# EAGLE design Board Bawah (EAGLE 9.6.2)
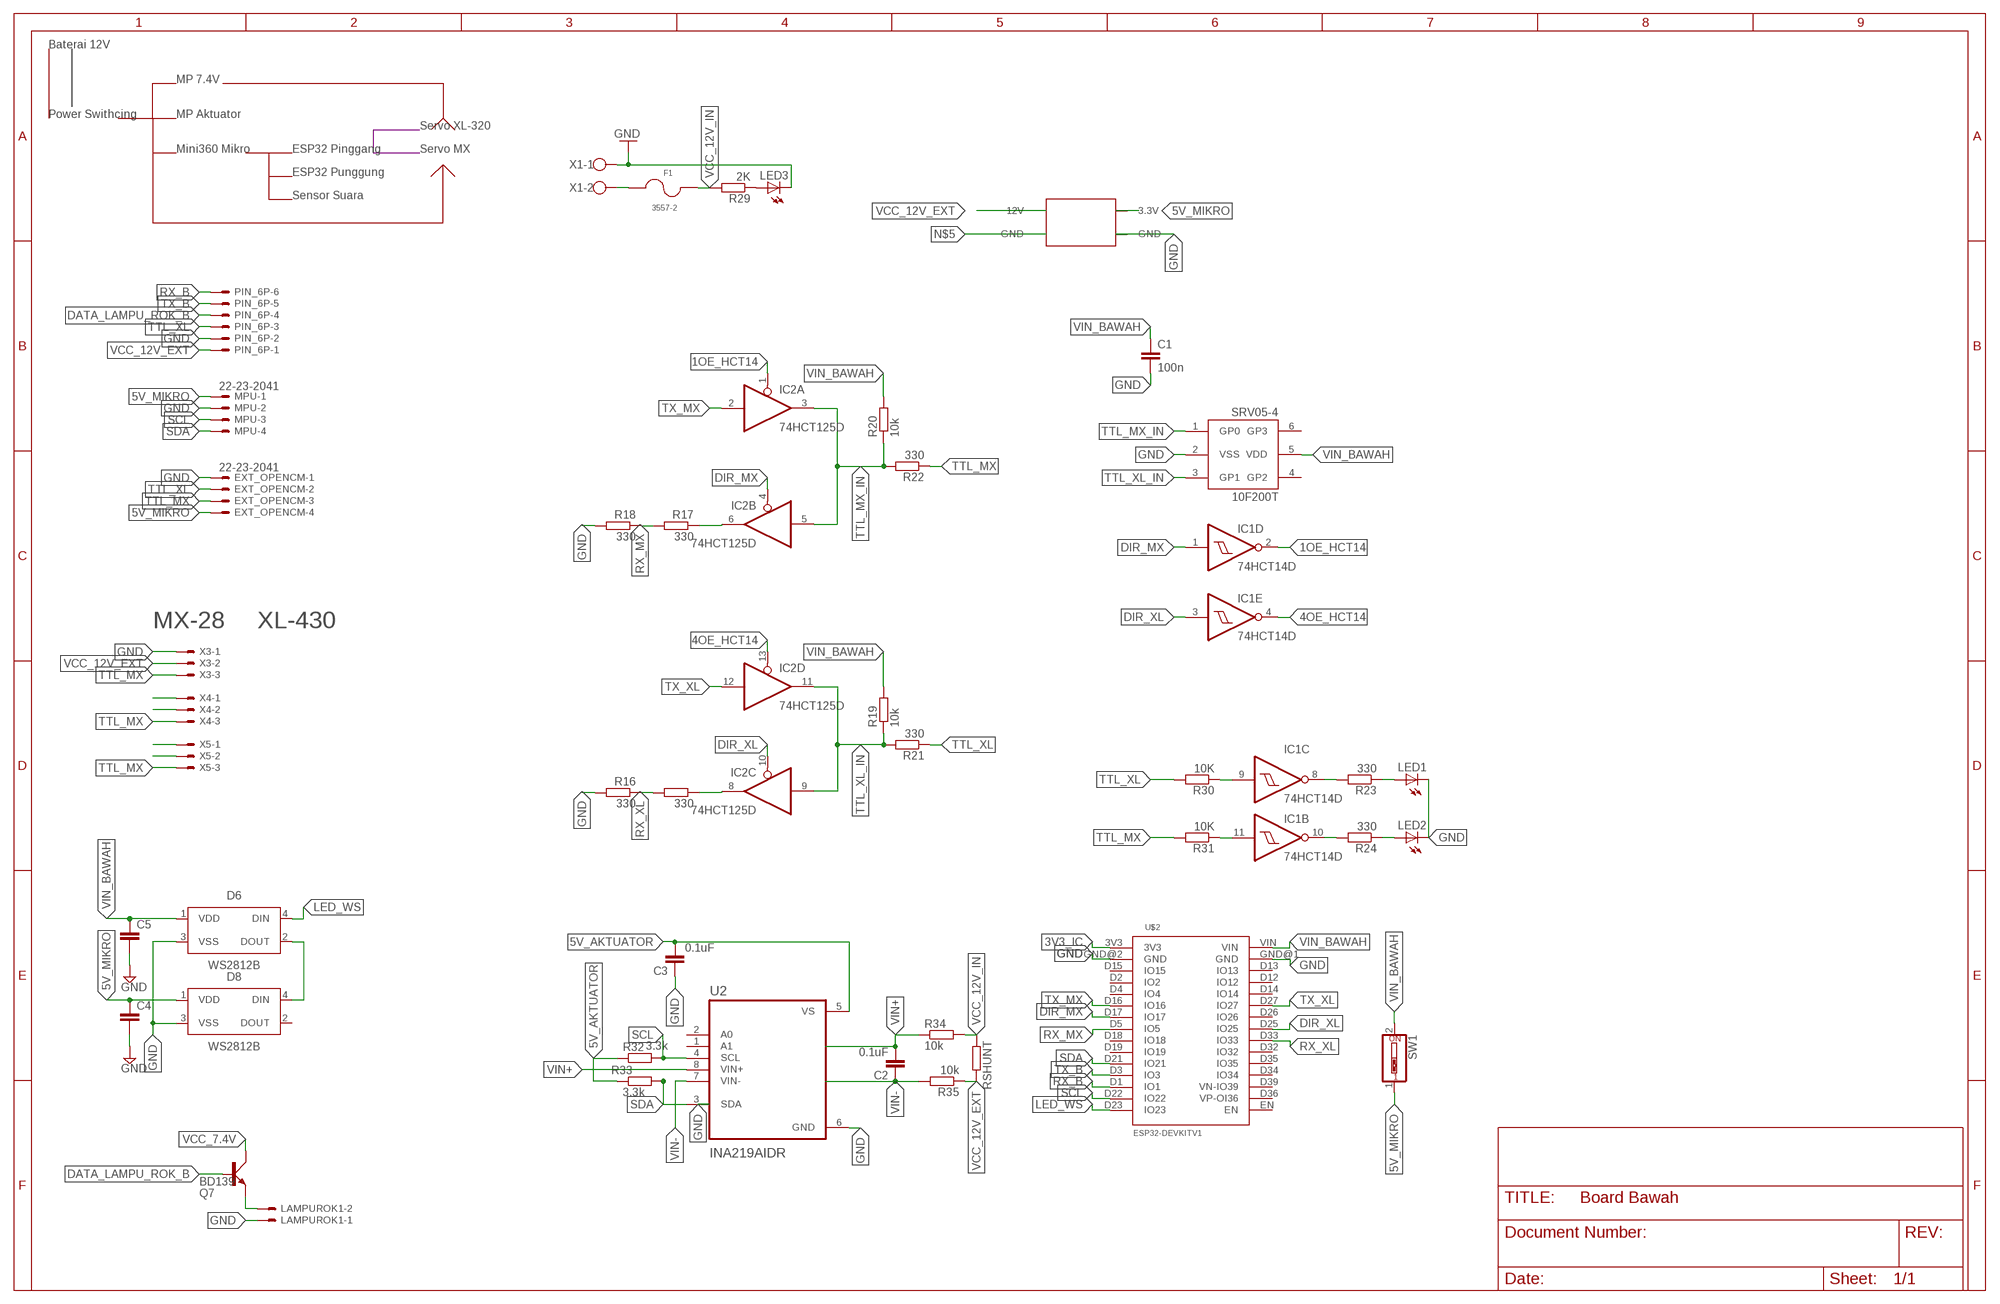
[diagram p0: schematic, sheet 1]

## Parts
C1  100n  C-EUC0805  [C0805]
C2  0.1uF  C-EUC0805  [C0805]
C3  0.1uF  C-EUC0805  [C0805]
C4  C-EUC0805  [C0805]
C5  C-EUC0805  [C0805]
D6  WS2812B  [WS2812B]
D8  WS2812B  [WS2812B]
EXT_OPENCM  22-23-2041  [22-23-2041]
F1  3557-2  [FUSE_3557-2]
IC1  74HCT14D  [SO14]
IC2  74HCT125D  [SO14]
LAMPUROK1  22-23-2021  [22-23-2021]
LED1  LEDCHIPLED_1206  [CHIPLED_1206]
LED2  LEDCHIPLED_1206  [CHIPLED_1206]
LED3  LEDCHIPLED_1206  [CHIPLED_1206]
MPU  22-23-2041  [22-23-2041]
PIN_6P  22-23-2061  [22-23-2061]
Q7  BD139  [TO126AV]
R13  330  R-EU_R0805  [R0805]
R16  330  R-EU_R0805  [R0805]
R17  330  R-EU_R0805  [R0805]
R18  330  R-EU_R0805  [R0805]
R19  10k  R-EU_R0805  [R0805]
R20  10k  R-EU_R0805  [R0805]
R21  330  R-EU_R0805  [R0805]
R22  330  R-EU_R0805  [R0805]
R23  330  R-EU_R0805  [R0805]
R24  330  R-EU_R0805  [R0805]
R29  2K  R-EU_R0805  [R0805]
R30  10K  R-EU_R0805  [R0805]
R31  10K  R-EU_R0805  [R0805]
R32  3.3k  R-EU_R0805  [R0805]
R33  3.3k  R-EU_R0805  [R0805]
R34  10k  R-EU_R0805  [R0805]
R35  10k  R-EU_R0805  [R0805]
RSHUNT  R-EU_R2512  [R2512]
SRV05-4  10F200T  [SOT23-6]
SW1  SW_DIP-1  [EDG-01]
U2  INA219AIDR  [SOIC127P599X175-8N]
U$2  ESP32DEVKITV1  [ESP32-DEVKITV1]
U$5  MP2307-MINI-360  [MP2307-MINI-360]
X1  W237-102  [W237-102]
X3  22-23-2031  [22-23-2031]
X4  22-23-2031  [22-23-2031]
X5  22-23-2031  [22-23-2031]

## Nets
1OE_HCT14: IC1.2(D:O) IC2.1(A:OE)
3V3_IC: U$2.3V3
4OE_HCT14: IC1.4(E:O) IC2.13(D:OE)
5V_AKTUATOR: C3.2 R32.1 R33.1 U2.5(VS)
5V_MIKRO: C4.1 D8.1(VDD) EXT_OPENCM.4 MPU.1 SW1.1 U$5.V+OUT(3.3V)
DATA_LAMPU_ROK_B: PIN_6P.4 Q7.B
DIR_MX: IC1.1(D:I) IC2.4(B:OE) U$2.D17(IO17)
DIR_XL: IC1.3(E:I) IC2.10(C:OE) U$2.D25(IO25)
GND: C1.2 C3.1 C4.2 C5.2 D6.3(VSS) D8.3(VSS) EXT_OPENCM.1 LAMPUROK1.1 LED1.C LED2.C LED3.C MPU.2 PIN_6P.2 R16.2 R18.2 SRV05-4.2(VSS) U2.6(GND) U$2.GND@1(GND) U$2.GND@2(GND) U$5.GND_OUT(GND) X1.1 X3.1 X4.1 X5.1
LED_WS: D6.4(DIN) U$2.D23(IO23)
N$1: LAMPUROK1.2 Q7.E
N$3: IC1.8(C:O) R23.2
N$5: U$5.GND_IN(GND)
N$7: IC1.9(C:I) R30.1
N$8: LED1.A R23.1
N$9: F1.1_1 F1.1_2 X1.2
N$10: IC1.10(B:O) R24.2
N$11: LED2.A R24.1
N$14: LED3.A R29.1
N$18: IC1.11(B:I) R31.1
N$21: IC2.6(B:O) R17.1
N$25: IC2.8(C:O) R13.1
N$26: D6.2(DOUT) D8.4(DIN)
RX_B: PIN_6P.6 U$2.D1(IO1)
RX_MX: R17.2 R18.1 U$2.D5(IO5)
RX_XL: R13.2 R16.1 U$2.D33(IO33)
SCL: MPU.3 R32.2 U2.4(SCL) U$2.D22(IO22)
SDA: MPU.4 R33.2 U2.3(SDA) U$2.D21(IO21)
TTL_MX: EXT_OPENCM.3 R22.1 R31.2 X3.3 X4.3 X5.3
TTL_MX_IN: IC2.3(A:O) IC2.5(B:I) R20.1 R22.2 SRV05-4.1(GP0)
TTL_XL: EXT_OPENCM.2 PIN_6P.3 R21.1 R30.2
TTL_XL_IN: IC2.9(C:I) IC2.11(D:O) R19.1 R21.2 SRV05-4.3(GP1)
TX_B: PIN_6P.5 U$2.D3(IO3)
TX_MX: IC2.2(A:I) U$2.D16(IO16)
TX_XL: IC2.12(D:I) U$2.D27(IO27)
VCC_7.4V: Q7.C
VCC_12V_EXT: PIN_6P.1 R35.1 RSHUNT.2 U$5.V+IN(12V) X3.2 X4.2 X5.2
VCC_12V_IN: F1.2_1 F1.2_2 R29.2 R34.2 RSHUNT.1
VIN+: C2.2 R34.1 U2.8(VIN+)
VIN-: C2.1 R35.2 U2.7(VIN-)
VIN_BAWAH: C1.1 C5.1 D6.1(VDD) R19.2 R20.2 SRV05-4.5(VDD) SW1.2 U$2.VIN
Unconnected: D8.2(DOUT) IC1.5(F:I) IC1.6(F:O) IC1.12(A:O) IC1.13(A:I) SRV05-4.4(GP2) SRV05-4.6(GP3) U2.1(A1) U2.2(A0) U$2.D2(IO2) U$2.D4(IO4) U$2.D12(IO12) U$2.D13(IO13) U$2.D14(IO14) U$2.D15(IO15) U$2.D18(IO18) U$2.D19(IO19) U$2.D26(IO26) U$2.D32(IO32) U$2.D34(IO34) U$2.D35(IO35) U$2.D36(VP-OI36) U$2.D39(VN-IO39) U$2.EN

## Notes on the sheet
- Baterai 12V
- MP 7.4V
- Power Swithcing | MP Aktuator
- Servo XL-320
- Mini360 Mikro | ESP32 Pinggang | Servo MX
- ESP32 Punggung
- Sensor Suara
- MX-28 | XL-430

## Power pins joined to a net without a drawn wire
GND: IC1.7(P:GND) IC2.7(P:GND)
VIN_BAWAH: IC1.14(P:VIN_BAWAH) IC2.14(P:VIN_BAWAH)

## Library data of the parts
C1-C5 = rcl:C-EU: CAPACITOR, European symbol; SPICEPREFIX: C
D6 D8 = LED:WS2812B: Intelligent control LED integrated light source Datasheet <http://cdn.sparkfun.com/datasheets/BreakoutBoards/WS2812B.pdf>; CATEGORY: LED; COLOR: RGB; DESCRIPTION: LED integrated light source; MANUFACTURER: Worldsemi; MPN: WS2812B; OPERATING_TEMP: -25 ℃ to +80℃(TJ); PART_STATUS: Active; SUB_CATEGORY: RGB
EXT_OPENCM MPU = con-molex:22-23-2041: .100" (2.54mm) Center Header - 4 Pin; MF: MOLEX; MPN: 22-23-2041; OC_FARNELL: 1462920; OC_NEWARK: 38C0355
F1 = 3557-2:3557-2: Check availability <https://pricing.snapeda.com/parts/3557-2/Keystone%20Electronics/view-part?ref=eda>; AVAILABILITY: In Stock; DESCRIPTION: THM 2 in 1 Auto Blade Holder; MF: Keystone Electronics; MP: 3557-2; PACKAGE: Nonstandard Keystone; PRICE: None; PURCHASE-URL: https://pricing.snapeda.com/search?q=3557-2&ref=eda
IC1 = 74xx-eu:74*14: Hex schmitt trigger INVERTER; SPICEPREFIX: I
IC2 = 74xx-eu:74*125: Quad bus BUFFER, 3-state
LAMPUROK1 = con-molex:22-23-2021: .100" (2.54mm) Center Header - 2 Pin; MF: MOLEX; MPN: 22-23-2021; OC_FARNELL: 1462926; OC_NEWARK: 25C3832
LED1-LED3 = led:LED: LED OSRAM: - CHIPLED LG R971, LG N971, LY N971, LG Q971, LY Q971, LO R971, LY R971 LH N974, LH R974 LS Q976, LO Q976, LY Q976 LO Q996 - Hyper CHIPLED LW Q18S LB Q993, LB Q99A, LB R99A - SideLED LS A670, LO A670, LY A670, LG A670, LP A670 LB A673, LV A673, LT A673, LW A673 LH A674 LY A675 LS A676, LA A676, LO A676, LY A676, LW A676 LS A679, LY A679, LG A679 - Hyper Micro SIDELED® LS Y876, LA Y876, LO Y876, LY Y876 LT Y87S - SmartLED LW L88C, LW L88S LB L89C, LB L89S, LG L890 LS L89K, LO L89K, LY L89K LS L896, LA L896, LO L896, LY L896 - TOPLED LS T670, LO T670, LY T670, LG T670, LP T670 LSG T670, LSP T670, LSY T670, LOP T670, LYG T670 LG T671, LOG T671, LSG T671 LB T673, LV T673, LT T673, LW T673 LH T674 LS T676, LA T676, LO T676, LY T676, LB T676, LH T676, LSB T676, LW T676 LB T67C, LV T67C, LT T67C, LS T67K, LO T67K, LY T67K, LW E67C LS E67B, LA E67B, LO E67B, LY E67B, LB E67C, LV E67C, LT E67C LW T67C LS T679, LY T679, LG T679 LS T770, LO T770, LY T770, LG T770, LP T770 LB T773, LV T773, LT T773, LW T773 LH T774 LS E675, LA E675, LY E675, LS T675 LS T776, LA T776, LO T776, LY T776, LB T776 LHGB T686 LT T68C, LB T68C - Hyper Mini TOPLED® LB M676 - Mini TOPLED Santana® LG M470 LS M47K, LO M47K, LY M47K Source: http://www.osram.convergy.de LUXEON: - LUMILED® LXK2-PW12-R00, LXK2-PW12-S00, LXK2-PW14-U00, LXK2-PW14-V00 LXK2-PM12-R00, LXK2-PM12-S00, LXK2-PM14-U00 LXK2-PE12-Q00, LXK2-PE12-R00, LXK2-PE12-S00, LXK2-PE14-T00, LXK2-PE14-U00 LXK2-PB12-K00, LXK2-PB12-L00, LXK2-PB12-M00, LXK2-PB14-N00, LXK2-PB14-P00, LXK2-PB14-Q00 LXK2-PR12-L00, LXK2-PR12-M00, LXK2-PR14-Q00, LXK2-PR14-R00 LXK2-PD12-Q00, LXK2-PD12-R00, LXK2-PD12-S00 LXK2-PH12-R00, LXK2-PH12-S00 LXK2-PL12-P00, LXK2-PL12-Q00, LXK2-PL12-R00 Source: www.luxeon.com KINGBRIGHT: KA-3528ASYC Source: www.kingbright.com
PIN_6P = con-molex:22-23-2061: .100" (2.54mm) Center Header - 6 Pin; MF: MOLEX; MPN: 22-23-2061; OC_FARNELL: 1462922; OC_NEWARK: 27C1933
Q7 = transistor-power:BD139: NPN TRANSISTOR
R13 R16-R24 R29-R35 = resistor:R-EU_: RESISTOR, European symbol
RSHUNT = rcl:R-EU_: RESISTOR, European symbol; SPICEPREFIX: R
SRV05-4 = adafruit:10F200T: PIC10F200/202/204/206 Ultra-small 8-bit PIC micros in SOT-23-6 and SOIC
SW1 = special:SW_DIP-1: DIP SWITCH
U2 = INA219AIDR:INA219AIDR: Check availability <https://pricing.snapeda.com/parts/INA219AIDR/Texas%20Instruments/view-part?ref=eda>; AVAILABILITY: In Stock; CHECK_PRICES: https://www.snapeda.com/parts/INA219AIDR/Texas+Instruments/view-part/?ref=eda; DESCRIPTION: 26-V 12-bit I2C output digital power monitor; MF: Texas Instruments; MP: INA219AIDR; PACKAGE: SOIC-8 Texas Instruments; PRICE: None; PURCHASE-URL: https://www.snapeda.com/api/url_track_click_mouser/?unipart_id=423666&manufacturer=Texas Instruments&part_name=INA219AIDR&search_term=ina219; SNAPEDA_LINK: https://www.snapeda.com/parts/INA219AIDR/Texas+Instruments/view-part/?ref=snap
U$2 = ESP32-DEVKITV1:ESP32DEVKITV1
U$5 = MP2307-MINI-360:MP2307-MINI-360
X1 = con-wago-500:W237-102: WAGO SCREW CLAMP; MPN: 237-102; OC_FARNELL: unknown; OC_NEWARK: 70K9898
X3-X5 = con-molex:22-23-2031: .100" (2.54mm) Center Header - 3 Pin; MF: MOLEX; MPN: 22-23-2031; OC_FARNELL: 1462950; OC_NEWARK: 30C0862

## Board
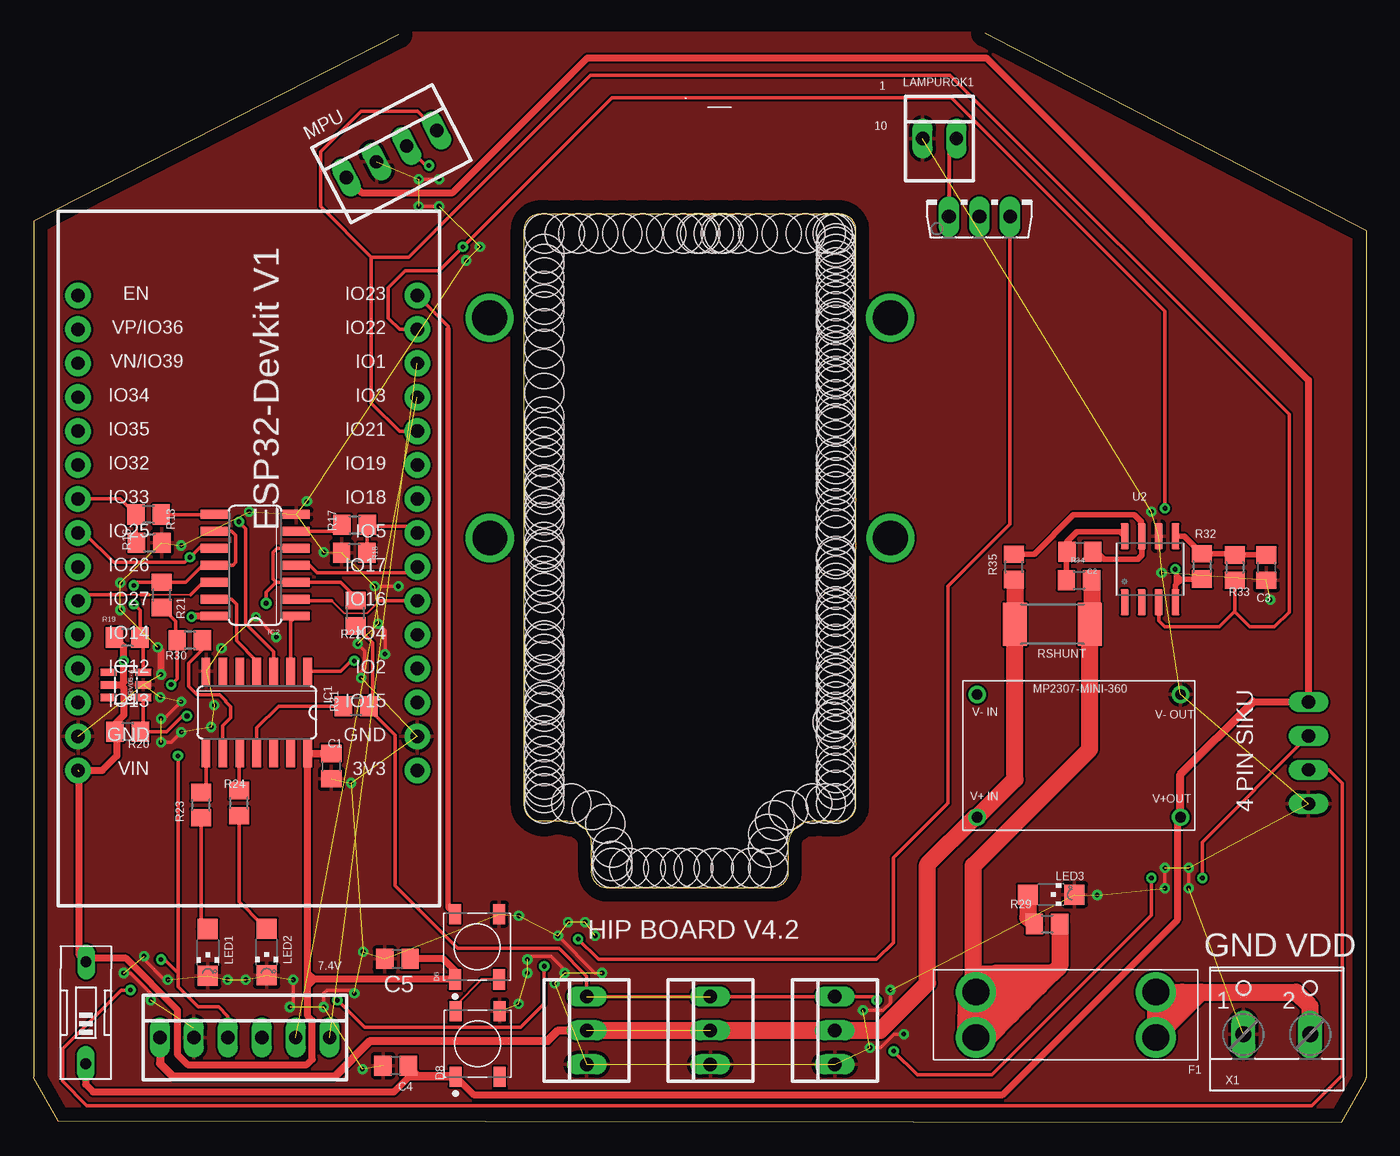
[diagram p1: board, top side]
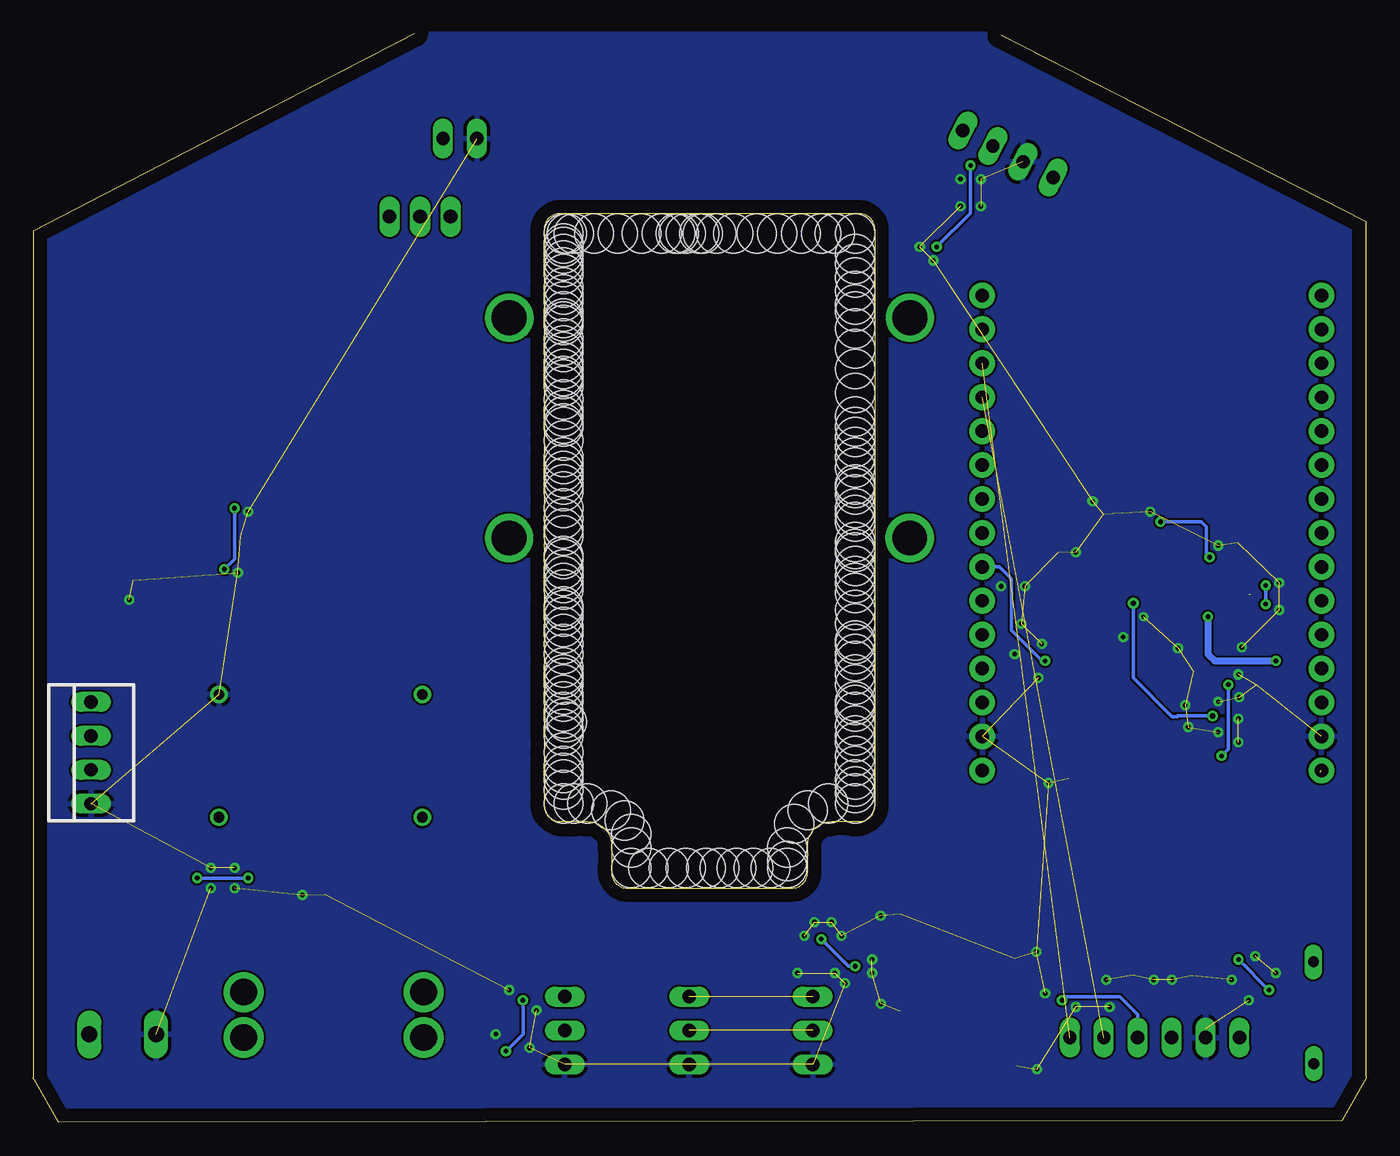
[diagram p2: board, bottom side, seen from below]

Size 99.8 x 81.53 mm. Coordinates in mm from the lower left corner, seen from the top.
Outline: 40.01,68.03 37.96,68.03 arc90 36.76,66.83 36.76,23.74 arc90 37.96,22.54 40.01,22.54 arc-90 41.81,20.74 41.81,18.74 arc90 43.01,17.54 55.31,17.54 arc90 56.51,18.74 56.51,20.74 arc-90 58.31,22.54 60.36,22.54 arc90 61.56,23.74 61.56,66.83 arc90 60.36,68.03 58.31,68.03
Outline: 39.94,68.03 58.39,68.03
Outline: 71.24,81.53 99.8,66.74 99.8,3.35 99.78,3.22 97.96,0 1.82,0.13 0,3.35 0.02,3.47 0.02,67.46 27.33,81.43
Copper layers (1*16): Top 0.035mm / dielectric 1.5mm / Bottom 0.035mm
Design rules "default": minimum track width 6mil, minimum drill 0.35mm, track to track 6mil, track to pad 6mil, pad to pad 6mil, via to via 6mil, smd to smd 6mil, copper to edge 40mil, drill to drill 6mil, minimum pad ring 10mil, minimum via ring 8mil, stop-mask expansion 4mil, vias tented up to drill 0mil, thermal gap 10mil
Holes 2.92 mm at 38.26,66.56 38.26,66.56 38.26,65.03 38.26,65.03 38.26,64.27 38.26,64.27 38.26,63.26 38.26,63.26 38.26,62.24 38.26,62.24 38.26,61.22 38.26,61.22 38.26,60.72 38.26,59.45 38.26,59.45 38.26,57.92 38.26,57.92 38.26,56.4 38.26,56.4 38.26,54.62 38.26,54.62 38.26,52.84 38.26,52.84 38.26,52.08 38.26,51.32 38.26,50.55 38.26,49.03 38.26,49.03 38.26,49.79 38.26,49.79 38.26,47.76 38.26,47.51 38.26,47 38.26,45.98 38.26,45.98 38.26,45.48 38.26,44.97 38.26,44.97 38.26,43.44 38.26,43.44 38.26,42.94 38.26,42.68 38.26,42.68 38.26,41.66 38.26,40.9 38.26,40.4 38.26,39.63 38.26,38.36 38.26,37.35 38.26,37.35 38.26,36.08 38.26,35.82 38.26,35.82 38.26,35.06 38.26,34.55 38.26,33.54 38.26,32.78 38.26,31.5 38.26,31.25 38.26,30.74 38.26,29.73 38.26,29.73 38.26,28.96 38.26,28.46 38.26,27.44 38.26,26.68 38.26,25.66 38.26,25.15 38.26,24.65 38.26,23.88 38.26,23.88 38.26,38.36 40.29,23.88 40.29,23.88 41.82,23.38 41.82,23.38 42.83,22.36 42.83,22.36 43.34,20.58 43.34,20.58 43.34,19.57 43.34,19.57 43.34,19.06 43.34,19.06 44.61,19.06 44.61,19.06 45.88,19.06 45.88,19.06 47.15,19.06 47.15,19.06 48.42,19.06 48.42,19.06 49.44,19.06 49.44,19.06 50.96,19.06 50.96,19.06 52.23,19.06 52.23,19.06 53.75,19.06 53.75,19.06 55.02,19.06 55.02,19.06 55.02,20.58 55.02,20.58 55.02,21.6 55.02,21.6 55.53,22.61 55.53,22.61 56.55,23.38 56.55,23.38 58.33,23.88 58.33,23.88 59.34,23.88 59.34,23.88 60.1,23.88 60.1,23.88 60.1,24.9 60.1,24.9 60.1,25.66 60.1,26.17 60.1,26.68 60.1,27.7 60.1,27.7 39.78,66.56 39.78,66.56 40.8,66.56 40.8,66.56 42.32,66.56 42.32,66.56 44.1,66.56 44.1,66.56 45.63,66.56 45.63,66.56 47.4,66.56 47.4,66.56 48.67,66.56 48.67,66.56 49.69,66.56 49.94,66.56 51.47,66.56 51.72,66.56 52.74,66.56 52.74,66.56 50.96,66.56 54.26,66.56 54.26,66.56 56.04,66.56 56.04,66.56 57.82,66.56 57.82,66.56 59.85,66.56 59.34,66.56 59.34,66.56 60.1,66.56 60.1,66.56 60.1,65.8 60.1,65.8 60.1,65.54 60.1,65.03 60.1,64.53 60.1,64.02 60.1,63.51 60.1,62.49 60.1,61.98 60.1,61.48 60.1,60.72 60.1,60.21 60.1,59.95 60.1,59.7 60.1,58.68 60.1,58.18 60.1,57.67 60.1,56.91 60.1,56.4 60.1,55.89 60.1,55.64 60.1,55.13 60.1,54.11 60.1,53.35 60.1,52.84 60.1,52.33 60.1,52.33 60.1,52.08 60.1,51.06 60.1,49.79 60.1,49.29 60.1,51.06 60.1,48.78 60.1,48.27 60.1,47.76 60.1,47.25 60.1,47.25 60.1,45.98 60.1,45.22 60.1,44.46 60.1,43.95 60.1,45.98 60.1,43.95 60.1,42.43 60.1,42.17 60.1,41.41 60.1,40.9 60.1,40.4 60.1,39.89 60.1,38.62 60.1,37.86 60.1,37.09 60.1,36.59 60.1,35.82 60.1,38.36 60.1,35.82 60.1,35.06 60.1,34.05 60.1,33.54 60.1,33.28 60.1,32.78 60.1,32.01 60.1,31.5 60.1,30.74 60.1,30.23 59.85,29.98 60.1,29.47 60.1,28.96

### Footprints (pad centres in the part's own frame; a part is rotated, then mirrored left to right if it is on the bottom)
C0805 = smd 1.3 x 1.5: 1 -0.95,0; 2 0.95,0
WS2812B = smd 1.5 x 0.9: 1 -2.45,1.65; 2 -2.45,-1.65; 3 2.45,-1.65; 4 2.45,1.65
22-23-2041 = drill 1 long: 1 -3.81,0; 2 -1.27,0; 3 1.27,0; 4 3.81,0
FUSE_3557-2 = drill 2: 1_1 -6.735,1.7; 1_2 -6.735,-1.7; 2_1 6.735,1.7; 2_2 6.735,-1.7
SO14 = smd 0.66 x 2.032: 1 -3.81,-3.073; 2 -2.54,-3.073; 3 -1.27,-3.073; 4 0,-3.073; 5 1.27,-3.073; 6 2.54,-3.073; 7 3.81,-3.073; 8 3.81,3.073; 9 2.54,3.073; 10 1.27,3.073; 11 0,3.073; 12 -1.27,3.073; 13 -2.54,3.073; 14 -3.81,3.073
22-23-2021 = drill 1 long: 1 -1.27,0; 2 1.27,0
CHIPLED_1206 = smd 1.5 x 1.5: A 0,-1.75; C 0,1.75
22-23-2061 = drill 1 long: 1 -6.35,0; 2 -3.81,0; 3 -1.27,0; 4 1.27,0; 5 3.81,0; 6 6.35,0
TO126AV = drill 1.016 long: B 2.286,-1.27; C 0,-1.27; E -2.286,-1.27
R0805 = smd 1.3 x 1.5: 1 -0.95,0; 2 0.95,0
R2512 = smd 1.8 x 3.2: 1 -2.8,0; 2 2.8,0
SOT23-6 = smd 0.55 x 1.2: 1 -0.95,-1.3; 2 0,-1.3; 3 0.95,-1.3; 4 0.95,1.3; 5 0,1.3; 6 -0.95,1.3
EDG-01 = drill 0.813 long: 1 0,-3.81; 2 0,3.81
SOIC127P599X175-8N = smd 1.97 x 0.6: 1 -2.47,1.905; 2 -2.47,0.635; 3 -2.47,-0.635; 4 -2.47,-1.905; 5 2.47,-1.905; 6 2.47,-0.635; 7 2.47,0.635; 8 2.47,1.905
ESP32-DEVKITV1 = drill 1 pad 1.93: 3V3 -16.52,-12.27; D1 13.96,-12.27; D2 -8.9,-12.27; D3 11.42,-12.27; D4 -6.36,-12.27; D5 1.26,-12.27; D12 -8.9,13.135; D13 -11.44,13.135; D14 -6.36,13.135; D15 -11.44,-12.27; D16 -3.82,-12.27; D17 -1.28,-12.27; D18 3.8,-12.27; D19 6.34,-12.27; D21 8.88,-12.27; D22 16.5,-12.27; D23 19.04,-12.27; D25 1.26,13.135; D26 -1.28,13.135; D27 -3.82,13.135; D32 6.34,13.135; D33 3.8,13.135; D34 11.42,13.135; D35 8.88,13.135; D36 16.5,13.135; D39 13.96,13.135; EN 19.04,13.135; GND@1 -13.98,13.135; GND@2 -13.98,-12.27; VIN -16.52,13.135
MP2307-MINI-360 = drill 0.8: GND_IN -6.55,5.08; GND_OUT 8.69,5.08; V+IN -6.55,-4.11; V+OUT 8.69,-4.11
W237-102 = drill 1.194 long: 1 -2.5,-1.27; 2 2.5,-1.27
22-23-2031 = drill 1 long: 1 -2.54,0; 2 0,0; 3 2.54,0

### Placement (x,y rotation side)
C1  22.32,26.68 270 top
C2  78.36,42.73 180 top
C3  92.34,41.54 90 top
C4  27.13,4.25 180 top
C5  27.26,12.25 180 top
D6  33.23,13.15 90 top
D8  33.26,5.88 90 top
EXT_OPENCM  95.48,27.67 90 bottom
F1  77.31,8.06 180 top
IC1  16.73,30.69 180 top
IC2  16.61,41.72 90 top
LAMPUROK1  67.86,73.66 0 top
LED1  13.07,12.73 180 top
LED2  17.47,12.76 180 top
LED3  76.21,17.06 270 top
MPU  26.82,72.5 27.5 top
PIN_6P  15.83,6.36 0 top
Q7  70.84,69.08 0 top
R13  8.62,45.51 180 top
R16  8.68,43.41 0 top
R17  24.06,44.75 0 top
R18  24.03,42.65 180 top
R19  7.03,36.3 180 top
R20  7.07,29.25 180 top
R21  9.62,39.49 90 top
R22  24.13,38.12 90 top
R23  12.55,23.76 90 top
R24  15.4,23.91 90 top
R29  75.91,14.86 0 top
R30  11.72,36.09 180 top
R31  24.17,31.16 0 top
R32  87.51,41.62 270 top
R33  89.97,41.54 270 top
R34  78.31,40.6 0 top
R35  73.43,41.59 90 top
RSHUNT  76.31,37.3 180 top
SRV05-4  6.94,32.75 90 top
SW1  3.93,8.21 359.8 top
U2  83.63,41.41 90 top
U$2  16.48,42.87 90 top
U$5  77.21,26.96 0 top
X1  93.11,7.86 0 top
X3  41.43,6.89 90 top
X4  50.7,6.89 90 top
X5  60.02,6.89 90 top

### Tracks (layer width: path | path; a pad name or v marks a point on that pad's centre or on a via)
1OE_HCT14
  Top 0.254: IC1.2 19.27,37.49 IC2.1
4OE_HCT14
  Top 0.254: IC2.13 14.84,39.18 15.21,38.81 15.21,36.05 16.73,34.53 IC1.4
5V_AKTUATOR
  Top 0.406: U2.5 86.21,43.88 R32.1 89.89,42.57 R33.1 C3.2
5V_MIKRO
  Top 0.508: SW1.1 3.92,2.86 4.48,2.29 27,2.29 28.13,3.43 D8.1 | D8.1 32.95,2.09 72.6,2.09 85.65,15.14 85.65,22.59 U$5.V+OUT | MPU.1 24.58,69.6 31.41,69.6 41.49,79.69 71.36,79.69 95.48,55.56 EXT_OPENCM.4 95.46,31.5 91.35,31.5 | D8.1 31.53,3.51 28.82,3.51 C4.1
  Top 0.61: 91.35,31.5 85.9,26.06 U$5.V+OUT
DATA_LAMPU_ROK_B  (via drill 0.35)
  Top 0.254: Q7.B 73.13,44.79 68.49,40.14 68.49,23.88 64.42,19.82 64.42,13.47 63.15,12.2 42.32,12.2 v40.8,13.72 | v38.26,11.69 38.26,8.9 36.48,7.12 24.8,7.12 v22.77,9.15
  Bottom 0.254: v40.8,13.72 38.77,11.69 v38.26,11.69 | v22.77,9.15 22.51,9.41 18.45,9.41 17.1,8.06 PIN_6P.4
DIR_MX  (via drill 0.35 pad 0.55)
  Top 0.2: IC2.4 20.68,41.72 | 28.31,41.16 U$2.D17
  Top 0.254: 20.68,41.72 21.24,41.16 28.31,41.16 | v24.04,34.55 23.78,34.55 22.99,33.76 IC1.1
  Bottom 0.254: U$2.D17 27.48,41.59 26.58,40.69 26.58,36.84 24.29,34.55 v24.04,34.55
DIR_XL  (via drill 0.35)
  Top 0.254: U$2.D25 3.79,44.13 6,41.92 11.34,41.92 12.49,43.07 13.46,43.07 IC2.10 12.41,42.99 v11.73,42.31 | IC1.3 18,35.25 15.91,37.35 15.91,44.46 v15.4,44.97
  Bottom 0.254: v15.4,44.97 12.35,44.97 11.98,44.6 11.98,42.56 v11.73,42.31
GND  (via drill 0.3, 0.35, 0.35 pad 0.55)  (72 unrouted)
  Top 0.254: v16.67,37.85 v18.19,36.33 | v24.54,33.28 24.54,33.73 24.8,33.98 24.8,35.32 v24.29,35.82 | v25.81,37.35 26.32,36.84 v26.32,35.06 | v25.56,40.14 v27.34,40.14 | v9.56,28.46 10.32,28.46 v11.08,29.22 | v9.56,30.23 9.81,30.23 v11.08,31.5 | v28.86,68.59 v30.39,68.59 | v28.86,70.62 v30.39,70.62 | v6.76,11.18 7.27,11.18 8.8,9.66 v8.8,9.15 | v8.29,12.45 8.29,12.2 9.81,10.68 v10.07,10.68 | v84.74,19.06 v84.74,17.53 | v86.52,19.06 v86.52,17.53 | v62.64,5.6 63.43,5.6 64.45,6.61 v65.18,6.61 | v62.14,8.39 63.64,8.39 64.17,8.92 v64.17,9.91 | v39.28,13.98 42.07,11.18 v42.58,11.18 | v36.99,12.2 37.24,12.45 38.77,12.45 39.78,11.44 v39.78,11.18 | v21.75,8.64 21.75,9.66 22,9.91 23.78,9.91 v24.04,9.66 | v19.46,10.68 19.46,8.9 v19.21,8.64
  Top 0.508: v9.56,33.54 9.56,35.31 v9.3,35.57
  Bottom 0.813: PIN_6P.2 12.02,7.04
  other vias: 6.51,40.4 6.51,38.36 11.08,43.19 16.16,45.73 83.73,45.73 84.49,41.16 14.54,10.68 15.91,10.68 23.78,25.41 14.08,35.49 20.48,46.49 21.75,42.68 79.66,17.03 36.35,15.48 36.33,8.87 92.62,39.12 36.99,11.18 39.02,10.42 40.04,14.99 41.31,14.99 42.07,13.98 32.42,64.53 33.43,65.54 9.51,31.84 13.55,31.23 13.32,29.6 24.65,4 24.7,12.79
  pour Bottom: 97.91,0.06 99.81,3.36 99.81,66.56 99.81,66.66 71.41,81.46 27.41,81.46 0.11,67.46 0.11,3.26 1.81,0.16
  pour Top: 0.16,67.57 0.16,3.31 0.16,3.06 1.94,0.01 97.95,0.01 99.73,3.31 99.73,66.81 71.28,81.54 27.34,81.54
LED_WS
  Top 0.254: 31.07,59.36 31.07,59.59 U$2.D23
  Top 0.406: 31.07,59.36 31.07,16.11 D6.4
N$1
  Top 0.305: LAMPUROK1.2 68.56,73.09 Q7.E
N$3
  Top 0.254: R23.2 12.92,25.08 IC1.8
N$7
  Top 0.254: IC1.9 14.19,29.71 14.77,30.29 14.77,31.12 14.38,31.51 14.38,31.57 13.93,32.01 12.25,32.01 11.62,32.65 11.62,34.38 12.67,35.43 R30.1
N$8
  Top 0.254: 12.41,14.48 LED1.A 12.55,15 R23.1 12.49,22.87
N$9
  Top 0.61: 95.61,8.69 95.54,8.77
  Top 1.27: F1.1_1 F1.1_2 86.01,9.76 | 86.01,9.76 87.45,9.76 | 87.45,9.76 94.55,9.76 95.54,8.77 | X1.2 95.61,8.69 | F1.1_1 87.45,9.76 | F1.1_1 84.05,7.79 86.01,9.76
N$10
  Top 0.254: R24.2 15.4,27.56 IC1.10
N$11
  Top 0.2: 17.45,14.49 LED2.A
  Top 0.254: 17.45,14.49 16.3,15.64 16.18,15.76 15.4,16.53 R24.1
N$14
  Top 1.27: R29.1 74.46,15.36 LED3.A
N$18
  Top 0.254: R31.1 18.36,31.16 16.73,29.53 IC1.11
N$21
  Top 0.2: R17.1 23.11,44.49 22.88,44.26
  Top 0.254: IC2.6 22.88,44.26
N$25
  Top 0.2: 13.52,45.51 IC2.8
  Top 0.254: R13.1 13.52,45.51
N$26
  Top 0.2: D6.2 33.58,10.7 31.61,8.73 D8.4
N$63  (via drill 2.6 pad 2.2)
  other vias: 64.18,43.76
N$67  (via drill 2.6 pad 2.2)
  other vias: 64.17,60.25
N$72  (via drill 2.6 pad 2.2)
  other vias: 34.17,43.75
N$76  (via drill 2.6 pad 2.2)
  other vias: 34.16,60.24
RX_B  (1 unrouted)
RX_MX
  Top 0.2: R17.2 25.11,44.64 | 28.24,44.64 U$2.D5 | R18.1 25.01,42.68
  Top 0.254: 28.24,44.64 25.11,44.64 | 25.01,42.68 R17.2
RX_XL
  Top 0.2: R16.1 7.73,45.45 R13.2
  Top 0.254: U$2.D33 6.51,46.67 R13.2
SCL  (via drill 0.35 pad 0.55)
  Top 0.254: v84.74,45.98 84.74,60.71 68.74,76.72 43.34,76.72 v32.16,65.54 30.39,63.76 27.85,63.76 26.58,62.49 26.58,60.21 27.41,59.37 U$2.D22 | v85.5,41.41 85.5,41.16 | 85.5,41.16 85.5,40.9 | 85.5,40.9 85.5,38.97 U2.4 | 86,40.67 85.73,40.67 85.5,40.9 | 86.27,40.67 85.99,40.67 85.5,41.16 | MPU.3 29.4,71.64 v29.62,71.64
  Top 0.406: U2.4 85.53,40.21 86,40.67 86.27,40.67 R32.2
  Bottom 0.254: v84.74,45.98 84.74,42.17 v85.5,41.41 | v29.62,71.64 29.62,68.08 v32.16,65.54
SDA
  Top 0.254: 25.31,64.78 25.31,53.86 27.41,51.75 U$2.D21 | U2.3 84.26,37.57 84.74,37.09 88.81,37.09 89.97,38.26 | R33.2 89.97,38.26 | 89.97,38.26 89.97,38.21 91.09,37.09 92.92,37.09 94.04,38.21 94.04,53.01 68.65,78.39 41.71,78.39 28.1,64.78 25.31,64.78 | MPU.4 28.76,75.7 24.54,75.7 21.5,72.65 21.5,68.59 25.31,64.78
TTL_MX  (via drill 0.35 pad 0.55)  (1 unrouted)
  Top 0.2: R31.2 25.4,31.45
  Top 0.254: R22.1 25.4,35.9 25.4,31.45 | R31.2 25.12,30.96 27.08,29 27.08,17.71 31.76,13.03 39.35,13.03 41.43,10.95 X3.3 X5.3 62.88,9.43 v63.15,9.15 | EXT_OPENCM.3 87.54,20.99 v87.54,18.3 | v83.73,18.3 83.73,15.5 71.79,3.56 66.2,3.56 v64.42,5.34
  Bottom 0.254: v87.54,18.3 v83.73,18.3 | v64.42,5.34 63.15,6.61 v63.15,9.15
TTL_MX_IN  (via drill 0.4)
  Top 0.2: R22.2 24.13,39.32
  Top 0.254: 18.19,40.45 IC2.3 23.01,40.45 24.13,39.32 | 18.19,40.45 18.14,40.45 17.94,40.65 17.94,42.68 18.25,42.99 IC2.5 | SRV05-4.1 8.24,29.46 R20.1 10,29.25 11.34,30.59 v11.49,30.43 | v17.43,38.87 17.43,39.69 18.19,40.45
  Bottom 0.254: v11.49,30.43 14.09,30.43 14.14,30.39 14.54,30.39 17.43,33.28 v17.43,38.87
TTL_XL  (via drill 0.35 pad 0.55)
  Top 0.254: R21.1 10.64,37.52 10.64,36.09 R30.2 10.77,33.22 v10.32,32.77 | v10.83,27.44 10.83,11.18 | v7.27,9.91 6.57,9.91 2.18,5.53 2.18,3.07 4,1.25 95.74,1.25 98.02,3.54 98.02,25.38 97.01,26.4 EXT_OPENCM.2 | 10.83,11.18 9.81,12.2 v9.56,12.2 | 10.83,11.18 10.83,10.17 12.35,8.64 13.88,8.64 14.56,7.96 PIN_6P.3
  Bottom 0.254: v10.32,32.77 10.32,27.95 v10.83,27.44 | v7.27,9.91 v9.56,12.2
TTL_XL_IN  (via drill 0.35)
  Top 0.254: IC2.9 14.84,44.26 15.15,43.95 15.15,41.92 14.95,41.72 IC2.11 12.68,41.72 11.4,40.44 R21.2 7.77,40.44 v7.53,40.19 | SRV05-4.3 8.24,36.05 R19.1 7.98,38.35 v7.53,38.8
  Bottom 0.254: v7.53,38.8 v7.53,40.19
TX_B  (1 unrouted)
TX_MX
  Top 0.127: IC2.2 19.81,39.05 | 22.34,39.05 23.26,38.13 25,38.13 25.93,39.05
  Top 0.254: 19.81,39.05 22.34,39.05 | 25.93,39.05 U$2.D16
TX_XL  (1 unrouted)
  Top 0.127: 6.76,39.5 8.03,39.5 | 8.8,39.5 11.76,39.5
  Top 0.254: IC2.12 12.71,40.45 11.76,39.5 | U$2.D27 3.79,39.5 6.76,39.5 | 8.03,39.5 8.66,39.5 8.67,39.49
VCC_12V_EXT  (1 unrouted)
  Top 0.61: PIN_6P.1 9.48,4.4 10.42,3.46 22.59,3.46 25.23,6.1 38.51,6.1 39.3,6.89 X3.2
  Top 1.27: R35.1 73.51,40.56 RSHUNT.2 73.51,25.69 U$5.V+IN 70.5,22.85 66.96,19.31 66.96,10.42 63.43,6.89 X5.2 X3.2
VCC_12V_IN
  Top 0.61: 71.98,11.16 71.7,11.44 70.38,11.44
  Top 1.27: R29.2 76.86,11.71 76.31,11.16 | 73.21,8.06 72.08,8.06 | 70.48,8.06 72.08,8.06 | 76.31,11.16 75.31,10.16 | 75.31,10.16 74.11,8.96 | 74.11,8.96 73.21,8.06 | 71.18,8.96 72.08,8.06 | 72.08,8.06 70.48,6.46 | F1.2_1 71.51,6.36 73.21,8.06 | 76.31,11.16 71.98,11.16 F1.2_2 70.38,9.96 70.38,11.44 70.38,19.22 79.11,27.95 RSHUNT.1 79.26,37.45 R34.2 | 75.31,10.16 70.98,10.16 70.48,9.66 71.18,8.96 | 74.11,8.96 71.18,8.96
  Top 2.54: F1.2_1 70.48,6.46 70.48,8.06 70.48,9.66 F1.2_2
VIN+
  Top 0.406: U2.8 81.4,44.2 78.14,44.2 77.41,43.48 C2.2 77.36,42.67 R34.1
VIN-
  Top 0.406: C2.1 79.62,42.73 80.17,42.17 82.71,42.17 82.99,42.46 U2.7 82.96,43.91 82.96,44.97 82.46,45.47 77.88,45.47 74.95,42.54 R35.2
VIN_BAWAH  (via drill 0.35 pad 0.55)  (1 unrouted)
  Top 0.305: 20.54,26.23 IC1.14 | 22.3,27.62 C1.1 | SRV05-4.5 5.66,32.77 6.51,32.77 | 6.51,32.77 6.76,33.03 v6.76,34.55 | 6.51,32.77 6.64,32.65 6.76,32.52
  Top 0.508: IC1.14 22.3,27.62 | IC1.14 20.56,27.63 C1.1 | U$2.VIN 5.17,26.35 6.26,27.44 6.26,29.11 R20.2 6.12,29.84 6.76,30.49 6.76,32.52 | SRV05-4.5 6.53,32.75 | 6.53,32.75 6.64,32.65 | 6.53,32.75 6.76,32.98 v6.76,34.55 6.76,35.62 R19.2 | IC2.14 11.9,37.91 v11.84,37.85 | 20.54,10.22 20.54,7.96 20.88,7.62 20.88,4.72 20.48,4.33 11.55,4.33 10.78,5.09 10.78,8.44 6.94,12.28 4.2,12.28 SW1.2 3.43,12.53 3.43,26.26 | 20.54,10.22 20.54,10.68 | 20.54,10.68 20.54,11.18 | 20.54,11.18 IC1.14 | 21.02,10.7 D6.1 31.58,11.36 30.69,12.25 C5.1 | 21.02,10.7 20.57,10.7 20.54,10.68 | 21.02,10.7 20.54,11.18 | 21.02,10.7 20.54,10.22
  Bottom 0.508: v11.84,37.85 11.84,35.06 11.34,34.55 v6.76,34.55

### Text on the board
tPlace: 1 | 10 | GND | VDD | 7.4V
tNames: 4 PIN SIKU | HIP BOARD V4.2